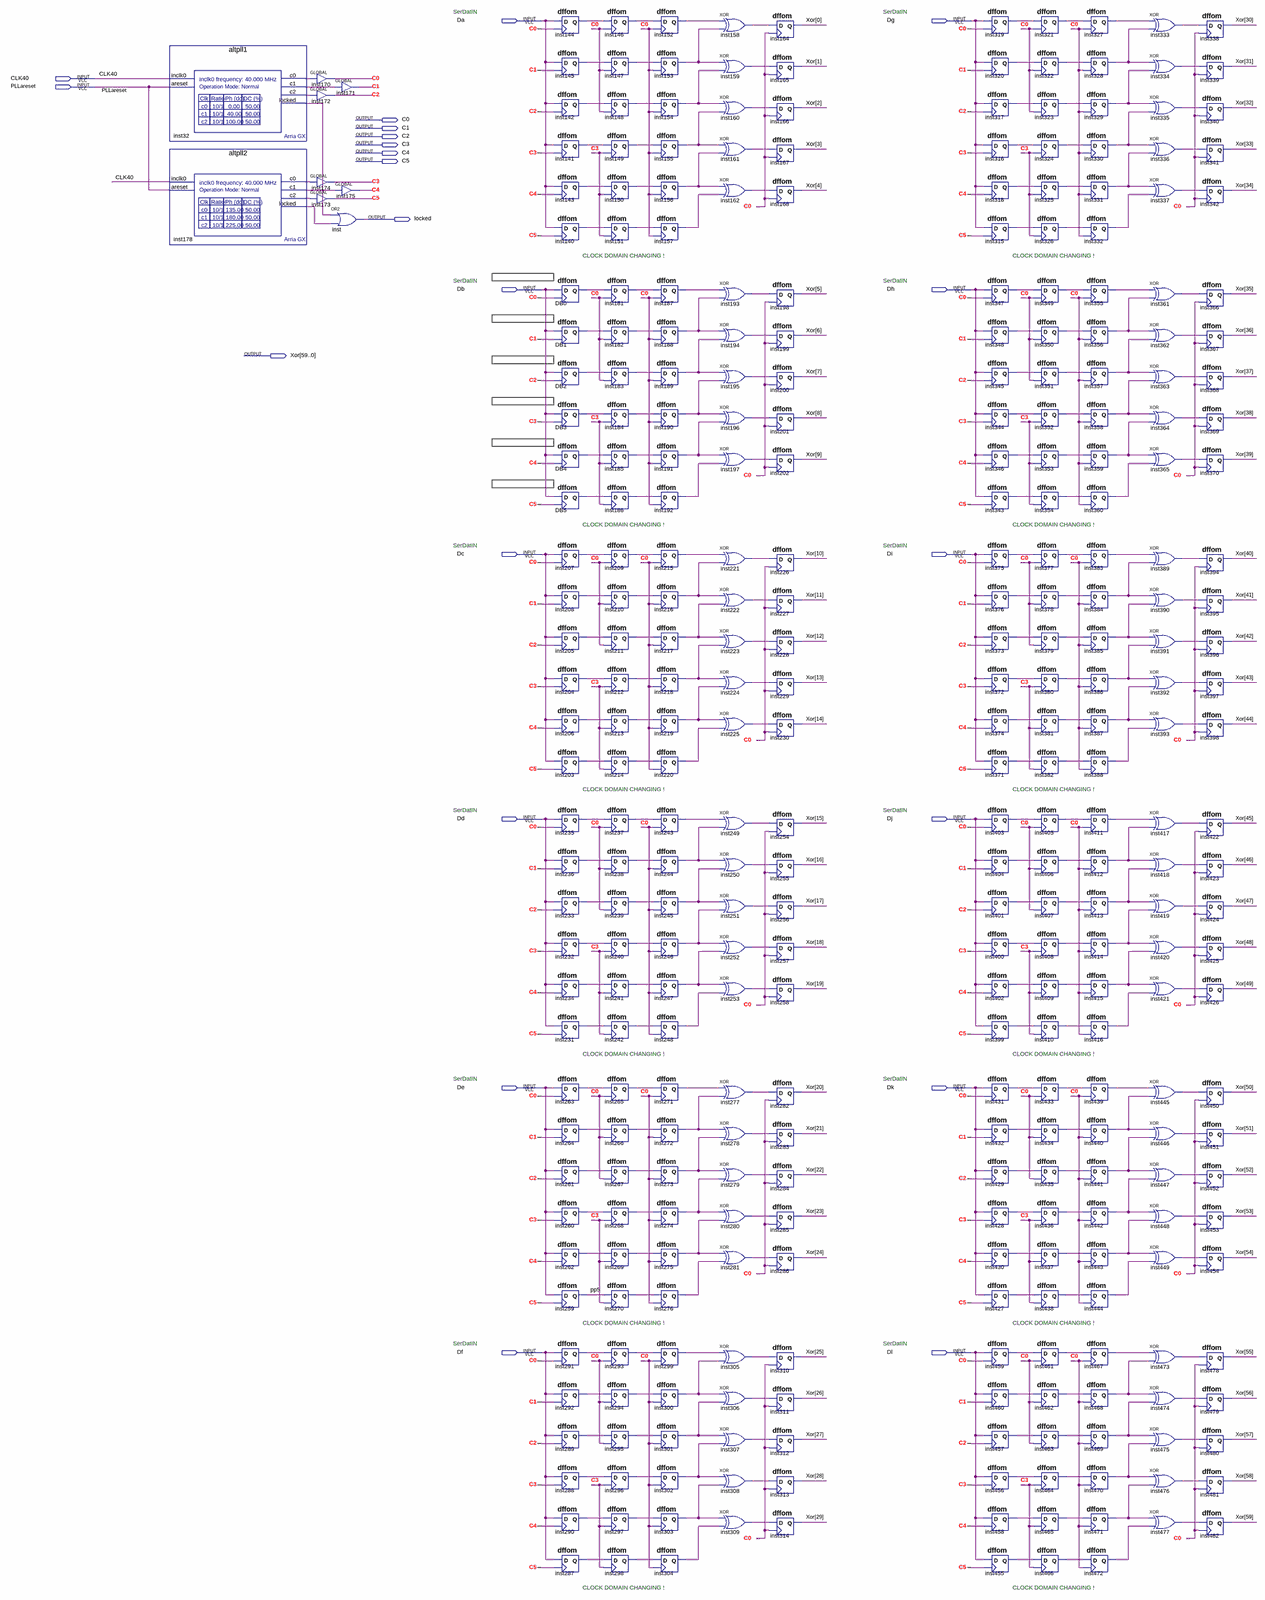
[diagram p0: schematic sheet, whole]
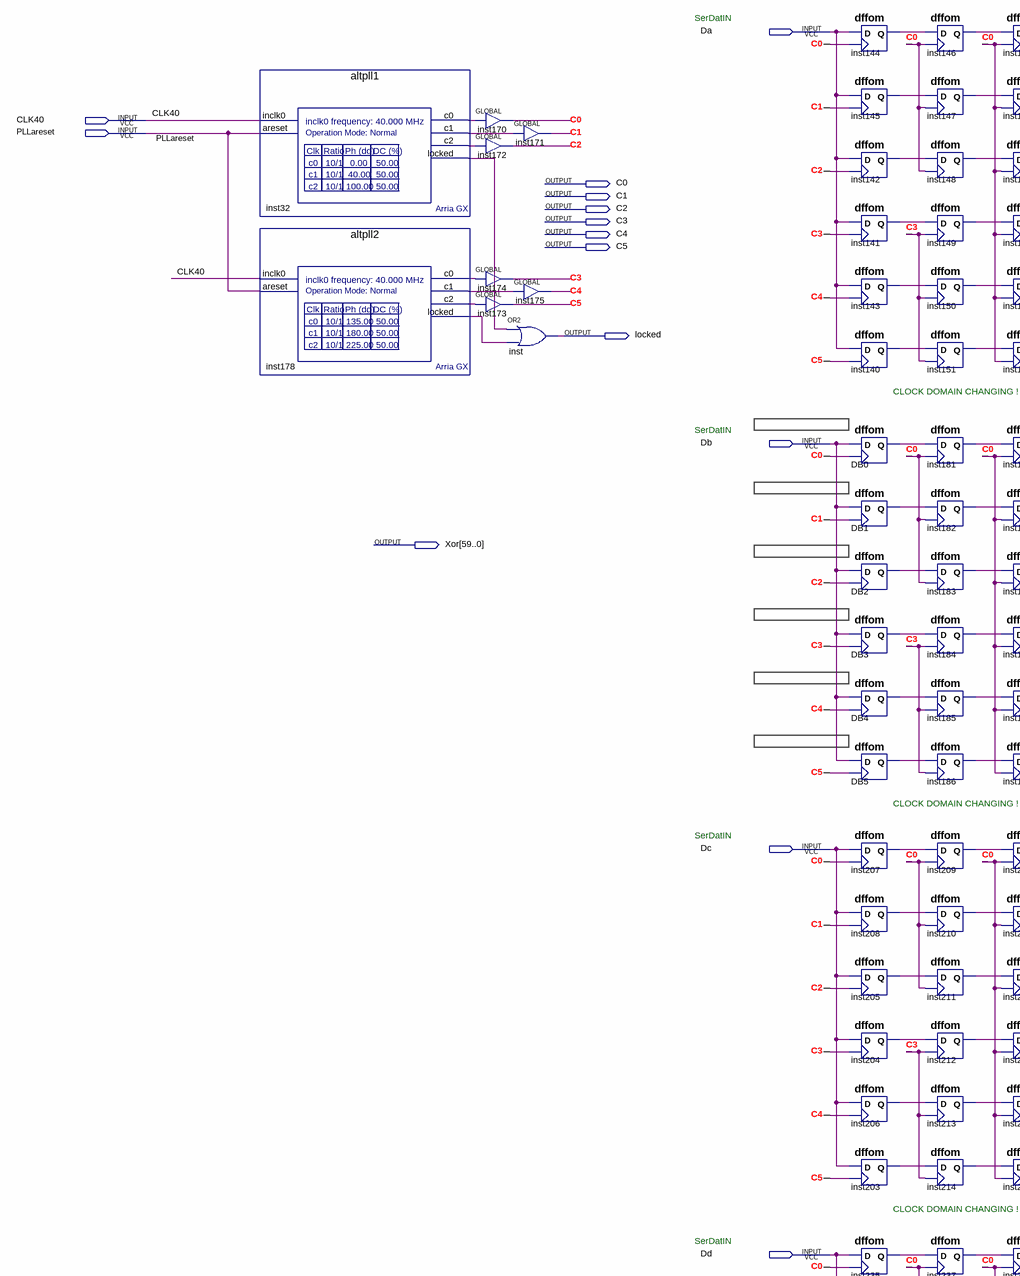
[diagram p1: schematic sheet, upper left part]
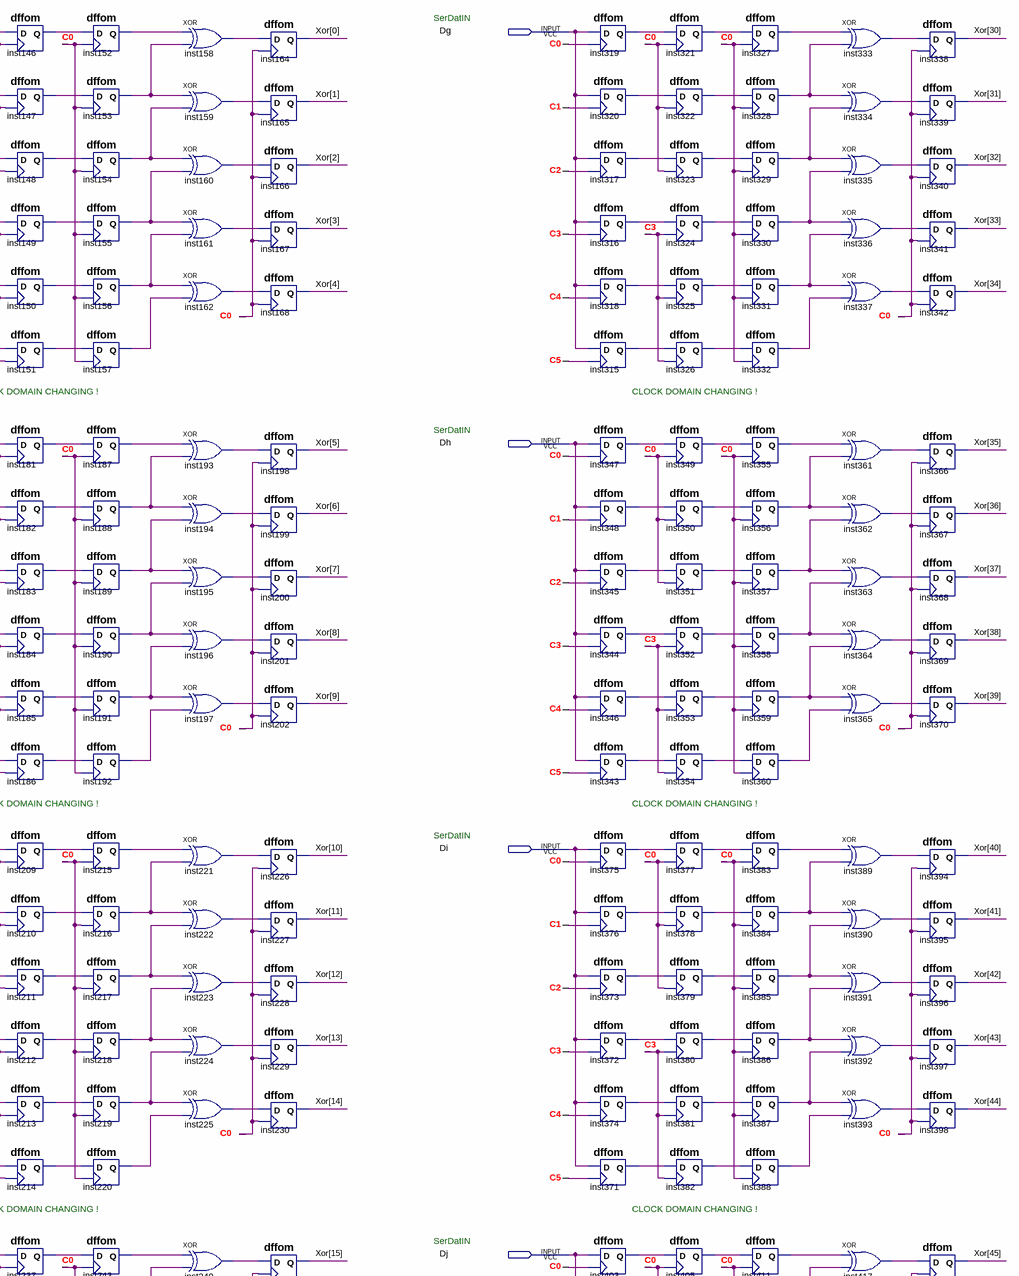
[diagram p2: schematic sheet, upper right part]
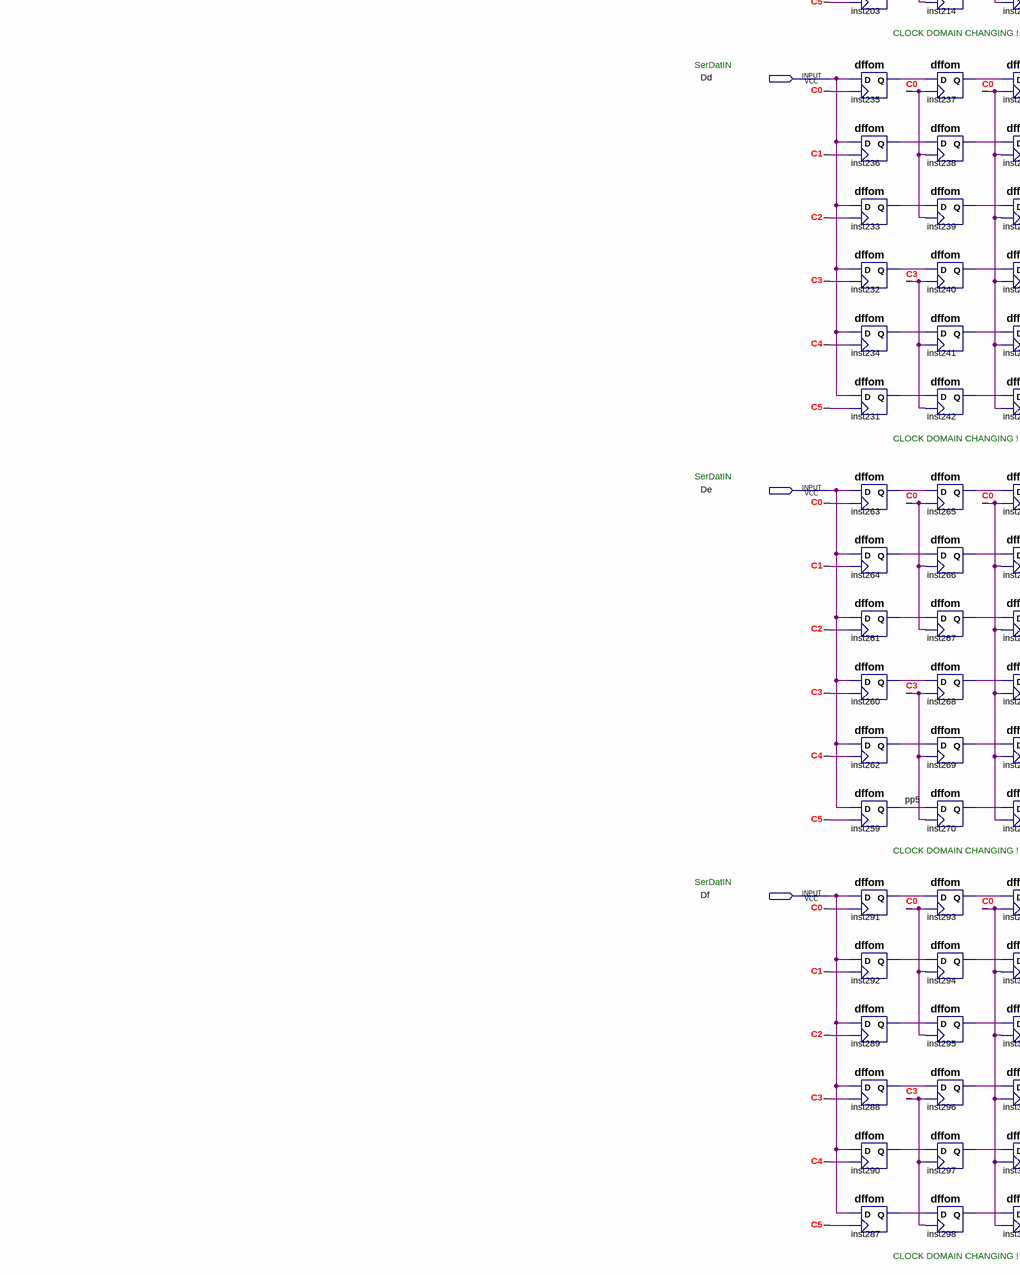
[diagram p3: schematic sheet, lower left part]
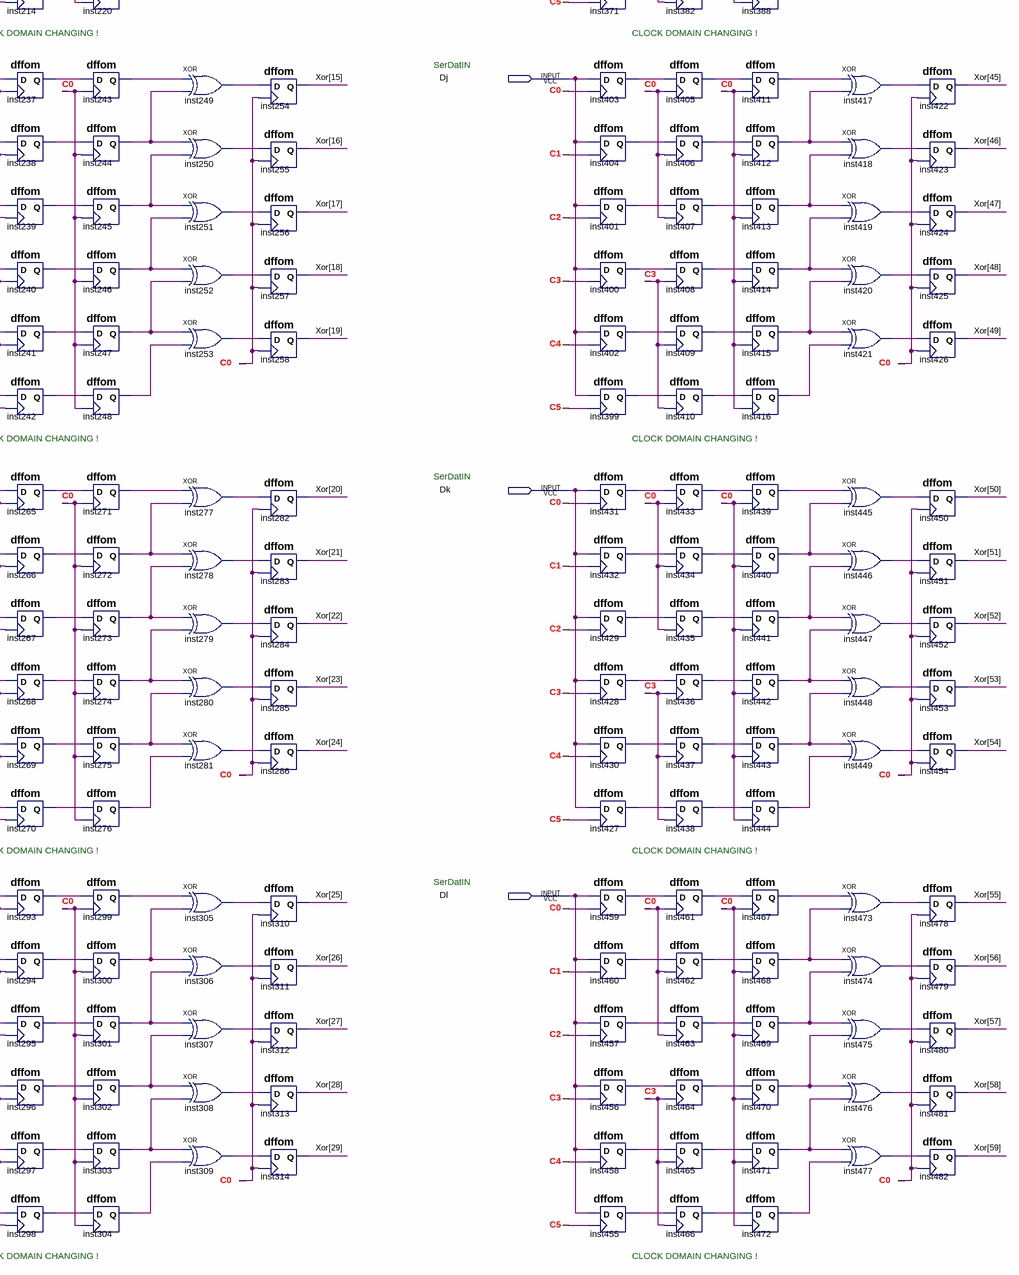
[diagram p4: schematic sheet, lower right part]
// Quartus schematic GXphase_finding.bdf as structural Verilog: 345 symbols, 22 pins
module GXphase_finding (
  input  Da,
  input  Dg,
  input  CLK40,
  input  PLLareset,
  input  Db,
  input  Dh,
  input  Dc,
  input  Di,
  input  Dd,
  input  Dj,
  input  De,
  input  Dk,
  input  Df,
  input  Dl,
  output C0,
  output C1,
  output C2,
  output C3,
  output C4,
  output C5,
  output locked,
  output [59:0] Xor
);

  wire DB0_q, DB1_q, DB2_q, DB3_q, DB4_q, DB5_q, inst32_c0, inst32_c1, inst32_c2, inst32_locked, inst140_q,
       inst141_q, inst142_q, inst143_q, inst144_q, inst145_q, inst146_q, inst147_q, inst148_q, inst149_q,
       inst150_q, inst151_q, inst152_q, inst153_q, inst154_q, inst155_q, inst156_q, inst157_q, inst158_out,
       inst159_out, inst160_out, inst161_out, inst162_out, inst178_c0, inst178_c1, inst178_c2,
       inst178_locked, inst181_q, inst182_q, inst183_q, inst184_q, inst185_q, inst186_q, inst187_q,
       inst188_q, inst189_q, inst190_q, inst191_q, inst192_q, inst193_out, inst194_out, inst195_out,
       inst196_out, inst197_out, inst203_q, inst204_q, inst205_q, inst206_q, inst207_q, inst208_q, inst209_q,
       inst210_q, inst211_q, inst212_q, inst213_q, inst214_q, inst215_q, inst216_q, inst217_q, inst218_q,
       inst219_q, inst220_q, inst221_out, inst222_out, inst223_out, inst224_out, inst225_out, inst231_q,
       inst232_q, inst233_q, inst234_q, inst235_q, inst236_q, inst237_q, inst238_q, inst239_q, inst240_q,
       inst241_q, inst242_q, inst243_q, inst244_q, inst245_q, inst246_q, inst247_q, inst248_q, inst249_out,
       inst250_out, inst251_out, inst252_out, inst253_out, inst260_q, inst261_q, inst262_q, inst263_q,
       inst264_q, inst265_q, inst266_q, inst267_q, inst268_q, inst269_q, inst270_q, inst271_q, inst272_q,
       inst273_q, inst274_q, inst275_q, inst276_q, inst277_out, inst278_out, inst279_out, inst280_out,
       inst281_out, inst287_q, inst288_q, inst289_q, inst290_q, inst291_q, inst292_q, inst293_q, inst294_q,
       inst295_q, inst296_q, inst297_q, inst298_q, inst299_q, inst300_q, inst301_q, inst302_q, inst303_q,
       inst304_q, inst305_out, inst306_out, inst307_out, inst308_out, inst309_out, inst315_q, inst316_q,
       inst317_q, inst318_q, inst319_q, inst320_q, inst321_q, inst322_q, inst323_q, inst324_q, inst325_q,
       inst326_q, inst327_q, inst328_q, inst329_q, inst330_q, inst331_q, inst332_q, inst333_out, inst334_out,
       inst335_out, inst336_out, inst337_out, inst343_q, inst344_q, inst345_q, inst346_q, inst347_q,
       inst348_q, inst349_q, inst350_q, inst351_q, inst352_q, inst353_q, inst354_q, inst355_q, inst356_q,
       inst357_q, inst358_q, inst359_q, inst360_q, inst361_out, inst362_out, inst363_out, inst364_out,
       inst365_out, inst371_q, inst372_q, inst373_q, inst374_q, inst375_q, inst376_q, inst377_q, inst378_q,
       inst379_q, inst380_q, inst381_q, inst382_q, inst383_q, inst384_q, inst385_q, inst386_q, inst387_q,
       inst388_q, inst389_out, inst390_out, inst391_out, inst392_out, inst393_out, inst399_q, inst400_q,
       inst401_q, inst402_q, inst403_q, inst404_q, inst405_q, inst406_q, inst407_q, inst408_q, inst409_q,
       inst410_q, inst411_q, inst412_q, inst413_q, inst414_q, inst415_q, inst416_q, inst417_out, inst418_out,
       inst419_out, inst420_out, inst421_out, inst427_q, inst428_q, inst429_q, inst430_q, inst431_q,
       inst432_q, inst433_q, inst434_q, inst435_q, inst436_q, inst437_q, inst438_q, inst439_q, inst440_q,
       inst441_q, inst442_q, inst443_q, inst444_q, inst445_out, inst446_out, inst447_out, inst448_out,
       inst449_out, inst455_q, inst456_q, inst457_q, inst458_q, inst459_q, inst460_q, inst461_q, inst462_q,
       inst463_q, inst464_q, inst465_q, inst466_q, inst467_q, inst468_q, inst469_q, inst470_q, inst471_q,
       inst472_q, inst473_out, inst474_out, inst475_out, inst476_out, inst477_out, pp5;

  altpll1 inst32 (
    .inclk0(CLK40), .areset(PLLareset), .c0(inst32_c0), .c1(inst32_c1), .c2(inst32_c2), .locked(inst32_locked));
  altpll2 inst178 (
    .inclk0(CLK40), .areset(PLLareset), .c0(inst178_c0), .c1(inst178_c1), .c2(inst178_c2),
    .locked(inst178_locked));
  GLOBAL inst170 (.IN(inst32_c0), .OUT(C0));
  GLOBAL inst172 (.IN(inst32_c2), .OUT(C2));
  GLOBAL inst174 (.IN(inst178_c0), .OUT(C3));
  GLOBAL inst173 (.IN(inst178_c2), .OUT(C5));
  GLOBAL inst171 (.IN(inst32_c1), .OUT(C1));
  GLOBAL inst175 (.IN(inst178_c1), .OUT(C4));
  or inst (locked, inst32_locked, inst178_locked);
  dffom inst144 (.D(Da), .CK(C0), .Q(inst144_q));
  dffom inst145 (.D(Da), .CK(C1), .Q(inst145_q));
  dffom inst142 (.D(Da), .CK(C2), .Q(inst142_q));
  dffom inst141 (.D(Da), .CK(C3), .Q(inst141_q));
  dffom inst143 (.D(Da), .CK(C4), .Q(inst143_q));
  dffom inst140 (.D(Da), .CK(C5), .Q(inst140_q));
  dffom DB0 (.D(Db), .CK(C0), .Q(DB0_q));
  dffom DB1 (.D(Db), .CK(C1), .Q(DB1_q));
  dffom DB2 (.D(Db), .CK(C2), .Q(DB2_q));
  dffom DB3 (.D(Db), .CK(C3), .Q(DB3_q));
  dffom DB4 (.D(Db), .CK(C4), .Q(DB4_q));
  dffom DB5 (.D(Db), .CK(C5), .Q(DB5_q));
  dffom inst207 (.D(Dc), .CK(C0), .Q(inst207_q));
  dffom inst208 (.D(Dc), .CK(C1), .Q(inst208_q));
  dffom inst205 (.D(Dc), .CK(C2), .Q(inst205_q));
  dffom inst204 (.D(Dc), .CK(C3), .Q(inst204_q));
  dffom inst206 (.D(Dc), .CK(C4), .Q(inst206_q));
  dffom inst203 (.D(Dc), .CK(C5), .Q(inst203_q));
  dffom inst235 (.D(Dd), .CK(C0), .Q(inst235_q));
  dffom inst236 (.D(Dd), .CK(C1), .Q(inst236_q));
  dffom inst233 (.D(Dd), .CK(C2), .Q(inst233_q));
  dffom inst232 (.D(Dd), .CK(C3), .Q(inst232_q));
  dffom inst234 (.D(Dd), .CK(C4), .Q(inst234_q));
  dffom inst231 (.D(Dd), .CK(C5), .Q(inst231_q));
  dffom inst263 (.D(De), .CK(C0), .Q(inst263_q));
  dffom inst264 (.D(De), .CK(C1), .Q(inst264_q));
  dffom inst261 (.D(De), .CK(C2), .Q(inst261_q));
  dffom inst260 (.D(De), .CK(C3), .Q(inst260_q));
  dffom inst262 (.D(De), .CK(C4), .Q(inst262_q));
  dffom inst259 (.D(De), .CK(C5), .Q(pp5));
  dffom inst291 (.D(Df), .CK(C0), .Q(inst291_q));
  dffom inst292 (.D(Df), .CK(C1), .Q(inst292_q));
  dffom inst289 (.D(Df), .CK(C2), .Q(inst289_q));
  dffom inst288 (.D(Df), .CK(C3), .Q(inst288_q));
  dffom inst290 (.D(Df), .CK(C4), .Q(inst290_q));
  dffom inst287 (.D(Df), .CK(C5), .Q(inst287_q));
  dffom inst146 (.D(inst144_q), .CK(C0), .Q(inst146_q));
  dffom inst147 (.D(inst145_q), .CK(C0), .Q(inst147_q));
  dffom inst148 (.D(inst142_q), .CK(C0), .Q(inst148_q));
  dffom inst149 (.D(inst141_q), .CK(C3), .Q(inst149_q));
  dffom inst150 (.D(inst143_q), .CK(C3), .Q(inst150_q));
  dffom inst151 (.D(inst140_q), .CK(C3), .Q(inst151_q));
  dffom inst181 (.D(DB0_q), .CK(C0), .Q(inst181_q));
  dffom inst182 (.D(DB1_q), .CK(C0), .Q(inst182_q));
  dffom inst183 (.D(DB2_q), .CK(C0), .Q(inst183_q));
  dffom inst184 (.D(DB3_q), .CK(C3), .Q(inst184_q));
  dffom inst185 (.D(DB4_q), .CK(C3), .Q(inst185_q));
  dffom inst186 (.D(DB5_q), .CK(C3), .Q(inst186_q));
  dffom inst209 (.D(inst207_q), .CK(C0), .Q(inst209_q));
  dffom inst210 (.D(inst208_q), .CK(C0), .Q(inst210_q));
  dffom inst211 (.D(inst205_q), .CK(C0), .Q(inst211_q));
  dffom inst212 (.D(inst204_q), .CK(C3), .Q(inst212_q));
  dffom inst213 (.D(inst206_q), .CK(C3), .Q(inst213_q));
  dffom inst214 (.D(inst203_q), .CK(C3), .Q(inst214_q));
  dffom inst237 (.D(inst235_q), .CK(C0), .Q(inst237_q));
  dffom inst238 (.D(inst236_q), .CK(C0), .Q(inst238_q));
  dffom inst239 (.D(inst233_q), .CK(C0), .Q(inst239_q));
  dffom inst240 (.D(inst232_q), .CK(C3), .Q(inst240_q));
  dffom inst241 (.D(inst234_q), .CK(C3), .Q(inst241_q));
  dffom inst242 (.D(inst231_q), .CK(C3), .Q(inst242_q));
  dffom inst265 (.D(inst263_q), .CK(C0), .Q(inst265_q));
  dffom inst266 (.D(inst264_q), .CK(C0), .Q(inst266_q));
  dffom inst267 (.D(inst261_q), .CK(C0), .Q(inst267_q));
  dffom inst268 (.D(inst260_q), .CK(C3), .Q(inst268_q));
  dffom inst269 (.D(inst262_q), .CK(C3), .Q(inst269_q));
  dffom inst270 (.D(pp5), .CK(C3), .Q(inst270_q));
  dffom inst293 (.D(inst291_q), .CK(C0), .Q(inst293_q));
  dffom inst294 (.D(inst292_q), .CK(C0), .Q(inst294_q));
  dffom inst295 (.D(inst289_q), .CK(C0), .Q(inst295_q));
  dffom inst296 (.D(inst288_q), .CK(C3), .Q(inst296_q));
  dffom inst297 (.D(inst290_q), .CK(C3), .Q(inst297_q));
  dffom inst298 (.D(inst287_q), .CK(C3), .Q(inst298_q));
  dffom inst152 (.D(inst146_q), .CK(C0), .Q(inst152_q));
  dffom inst153 (.D(inst147_q), .CK(C0), .Q(inst153_q));
  dffom inst154 (.D(inst148_q), .CK(C0), .Q(inst154_q));
  dffom inst155 (.D(inst149_q), .CK(C0), .Q(inst155_q));
  dffom inst156 (.D(inst150_q), .CK(C0), .Q(inst156_q));
  dffom inst157 (.D(inst151_q), .CK(C0), .Q(inst157_q));
  dffom inst187 (.D(inst181_q), .CK(C0), .Q(inst187_q));
  dffom inst188 (.D(inst182_q), .CK(C0), .Q(inst188_q));
  dffom inst189 (.D(inst183_q), .CK(C0), .Q(inst189_q));
  dffom inst190 (.D(inst184_q), .CK(C0), .Q(inst190_q));
  dffom inst191 (.D(inst185_q), .CK(C0), .Q(inst191_q));
  dffom inst192 (.D(inst186_q), .CK(C0), .Q(inst192_q));
  dffom inst215 (.D(inst209_q), .CK(C0), .Q(inst215_q));
  dffom inst216 (.D(inst210_q), .CK(C0), .Q(inst216_q));
  dffom inst217 (.D(inst211_q), .CK(C0), .Q(inst217_q));
  dffom inst218 (.D(inst212_q), .CK(C0), .Q(inst218_q));
  dffom inst219 (.D(inst213_q), .CK(C0), .Q(inst219_q));
  dffom inst220 (.D(inst214_q), .CK(C0), .Q(inst220_q));
  dffom inst243 (.D(inst237_q), .CK(C0), .Q(inst243_q));
  dffom inst244 (.D(inst238_q), .CK(C0), .Q(inst244_q));
  dffom inst245 (.D(inst239_q), .CK(C0), .Q(inst245_q));
  dffom inst246 (.D(inst240_q), .CK(C0), .Q(inst246_q));
  dffom inst247 (.D(inst241_q), .CK(C0), .Q(inst247_q));
  dffom inst248 (.D(inst242_q), .CK(C0), .Q(inst248_q));
  dffom inst271 (.D(inst265_q), .CK(C0), .Q(inst271_q));
  dffom inst272 (.D(inst266_q), .CK(C0), .Q(inst272_q));
  dffom inst273 (.D(inst267_q), .CK(C0), .Q(inst273_q));
  dffom inst274 (.D(inst268_q), .CK(C0), .Q(inst274_q));
  dffom inst275 (.D(inst269_q), .CK(C0), .Q(inst275_q));
  dffom inst276 (.D(inst270_q), .CK(C0), .Q(inst276_q));
  dffom inst299 (.D(inst293_q), .CK(C0), .Q(inst299_q));
  dffom inst300 (.D(inst294_q), .CK(C0), .Q(inst300_q));
  dffom inst301 (.D(inst295_q), .CK(C0), .Q(inst301_q));
  dffom inst302 (.D(inst296_q), .CK(C0), .Q(inst302_q));
  dffom inst303 (.D(inst297_q), .CK(C0), .Q(inst303_q));
  dffom inst304 (.D(inst298_q), .CK(C0), .Q(inst304_q));
  xor inst158 (inst158_out, inst152_q, inst153_q);
  xor inst159 (inst159_out, inst153_q, inst154_q);
  xor inst160 (inst160_out, inst154_q, inst155_q);
  xor inst161 (inst161_out, inst155_q, inst156_q);
  xor inst162 (inst162_out, inst156_q, inst157_q);
  xor inst193 (inst193_out, inst187_q, inst188_q);
  xor inst194 (inst194_out, inst188_q, inst189_q);
  xor inst195 (inst195_out, inst189_q, inst190_q);
  xor inst196 (inst196_out, inst190_q, inst191_q);
  xor inst197 (inst197_out, inst191_q, inst192_q);
  xor inst221 (inst221_out, inst215_q, inst216_q);
  xor inst222 (inst222_out, inst216_q, inst217_q);
  xor inst223 (inst223_out, inst217_q, inst218_q);
  xor inst224 (inst224_out, inst218_q, inst219_q);
  xor inst225 (inst225_out, inst219_q, inst220_q);
  xor inst249 (inst249_out, inst243_q, inst244_q);
  xor inst250 (inst250_out, inst244_q, inst245_q);
  xor inst251 (inst251_out, inst245_q, inst246_q);
  xor inst252 (inst252_out, inst246_q, inst247_q);
  xor inst253 (inst253_out, inst247_q, inst248_q);
  xor inst277 (inst277_out, inst271_q, inst272_q);
  xor inst278 (inst278_out, inst272_q, inst273_q);
  xor inst279 (inst279_out, inst273_q, inst274_q);
  xor inst280 (inst280_out, inst274_q, inst275_q);
  xor inst281 (inst281_out, inst275_q, inst276_q);
  xor inst305 (inst305_out, inst299_q, inst300_q);
  xor inst306 (inst306_out, inst300_q, inst301_q);
  xor inst307 (inst307_out, inst301_q, inst302_q);
  xor inst308 (inst308_out, inst302_q, inst303_q);
  xor inst309 (inst309_out, inst303_q, inst304_q);
  dffom inst164 (.D(inst158_out), .CK(C0), .Q(Xor[0]));
  dffom inst165 (.D(inst159_out), .CK(C0), .Q(Xor[1]));
  dffom inst166 (.D(inst160_out), .CK(C0), .Q(Xor[2]));
  dffom inst167 (.D(inst161_out), .CK(C0), .Q(Xor[3]));
  dffom inst168 (.D(inst162_out), .CK(C0), .Q(Xor[4]));
  dffom inst198 (.D(inst193_out), .CK(C0), .Q(Xor[5]));
  dffom inst199 (.D(inst194_out), .CK(C0), .Q(Xor[6]));
  dffom inst200 (.D(inst195_out), .CK(C0), .Q(Xor[7]));
  dffom inst201 (.D(inst196_out), .CK(C0), .Q(Xor[8]));
  dffom inst202 (.D(inst197_out), .CK(C0), .Q(Xor[9]));
  dffom inst226 (.D(inst221_out), .CK(C0), .Q(Xor[10]));
  dffom inst227 (.D(inst222_out), .CK(C0), .Q(Xor[11]));
  dffom inst228 (.D(inst223_out), .CK(C0), .Q(Xor[12]));
  dffom inst229 (.D(inst224_out), .CK(C0), .Q(Xor[13]));
  dffom inst230 (.D(inst225_out), .CK(C0), .Q(Xor[14]));
  dffom inst254 (.D(inst249_out), .CK(C0), .Q(Xor[15]));
  dffom inst255 (.D(inst250_out), .CK(C0), .Q(Xor[16]));
  dffom inst256 (.D(inst251_out), .CK(C0), .Q(Xor[17]));
  dffom inst257 (.D(inst252_out), .CK(C0), .Q(Xor[18]));
  dffom inst258 (.D(inst253_out), .CK(C0), .Q(Xor[19]));
  dffom inst282 (.D(inst277_out), .CK(C0), .Q(Xor[20]));
  dffom inst283 (.D(inst278_out), .CK(C0), .Q(Xor[21]));
  dffom inst284 (.D(inst279_out), .CK(C0), .Q(Xor[22]));
  dffom inst285 (.D(inst280_out), .CK(C0), .Q(Xor[23]));
  dffom inst286 (.D(inst281_out), .CK(C0), .Q(Xor[24]));
  dffom inst310 (.D(inst305_out), .CK(C0), .Q(Xor[25]));
  dffom inst311 (.D(inst306_out), .CK(C0), .Q(Xor[26]));
  dffom inst312 (.D(inst307_out), .CK(C0), .Q(Xor[27]));
  dffom inst313 (.D(inst308_out), .CK(C0), .Q(Xor[28]));
  dffom inst314 (.D(inst309_out), .CK(C0), .Q(Xor[29]));
  dffom inst319 (.D(Dg), .CK(C0), .Q(inst319_q));
  dffom inst320 (.D(Dg), .CK(C1), .Q(inst320_q));
  dffom inst317 (.D(Dg), .CK(C2), .Q(inst317_q));
  dffom inst316 (.D(Dg), .CK(C3), .Q(inst316_q));
  dffom inst318 (.D(Dg), .CK(C4), .Q(inst318_q));
  dffom inst315 (.D(Dg), .CK(C5), .Q(inst315_q));
  dffom inst347 (.D(Dh), .CK(C0), .Q(inst347_q));
  dffom inst348 (.D(Dh), .CK(C1), .Q(inst348_q));
  dffom inst345 (.D(Dh), .CK(C2), .Q(inst345_q));
  dffom inst344 (.D(Dh), .CK(C3), .Q(inst344_q));
  dffom inst346 (.D(Dh), .CK(C4), .Q(inst346_q));
  dffom inst343 (.D(Dh), .CK(C5), .Q(inst343_q));
  dffom inst375 (.D(Di), .CK(C0), .Q(inst375_q));
  dffom inst376 (.D(Di), .CK(C1), .Q(inst376_q));
  dffom inst373 (.D(Di), .CK(C2), .Q(inst373_q));
  dffom inst372 (.D(Di), .CK(C3), .Q(inst372_q));
  dffom inst374 (.D(Di), .CK(C4), .Q(inst374_q));
  dffom inst371 (.D(Di), .CK(C5), .Q(inst371_q));
  dffom inst403 (.D(Dj), .CK(C0), .Q(inst403_q));
  dffom inst404 (.D(Dj), .CK(C1), .Q(inst404_q));
  dffom inst401 (.D(Dj), .CK(C2), .Q(inst401_q));
  dffom inst400 (.D(Dj), .CK(C3), .Q(inst400_q));
  dffom inst402 (.D(Dj), .CK(C4), .Q(inst402_q));
  dffom inst399 (.D(Dj), .CK(C5), .Q(inst399_q));
  dffom inst431 (.D(Dk), .CK(C0), .Q(inst431_q));
  dffom inst432 (.D(Dk), .CK(C1), .Q(inst432_q));
  dffom inst429 (.D(Dk), .CK(C2), .Q(inst429_q));
  dffom inst428 (.D(Dk), .CK(C3), .Q(inst428_q));
  dffom inst430 (.D(Dk), .CK(C4), .Q(inst430_q));
  dffom inst427 (.D(Dk), .CK(C5), .Q(inst427_q));
  dffom inst459 (.D(Dl), .CK(C0), .Q(inst459_q));
  dffom inst460 (.D(Dl), .CK(C1), .Q(inst460_q));
  dffom inst457 (.D(Dl), .CK(C2), .Q(inst457_q));
  dffom inst456 (.D(Dl), .CK(C3), .Q(inst456_q));
  dffom inst458 (.D(Dl), .CK(C4), .Q(inst458_q));
  dffom inst455 (.D(Dl), .CK(C5), .Q(inst455_q));
  dffom inst321 (.D(inst319_q), .CK(C0), .Q(inst321_q));
  dffom inst322 (.D(inst320_q), .CK(C0), .Q(inst322_q));
  dffom inst323 (.D(inst317_q), .CK(C0), .Q(inst323_q));
  dffom inst324 (.D(inst316_q), .CK(C3), .Q(inst324_q));
  dffom inst325 (.D(inst318_q), .CK(C3), .Q(inst325_q));
  dffom inst326 (.D(inst315_q), .CK(C3), .Q(inst326_q));
  dffom inst349 (.D(inst347_q), .CK(C0), .Q(inst349_q));
  dffom inst350 (.D(inst348_q), .CK(C0), .Q(inst350_q));
  dffom inst351 (.D(inst345_q), .CK(C0), .Q(inst351_q));
  dffom inst352 (.D(inst344_q), .CK(C3), .Q(inst352_q));
  dffom inst353 (.D(inst346_q), .CK(C3), .Q(inst353_q));
  dffom inst354 (.D(inst343_q), .CK(C3), .Q(inst354_q));
  dffom inst377 (.D(inst375_q), .CK(C0), .Q(inst377_q));
  dffom inst378 (.D(inst376_q), .CK(C0), .Q(inst378_q));
  dffom inst379 (.D(inst373_q), .CK(C0), .Q(inst379_q));
  dffom inst380 (.D(inst372_q), .CK(C3), .Q(inst380_q));
  dffom inst381 (.D(inst374_q), .CK(C3), .Q(inst381_q));
  dffom inst382 (.D(inst371_q), .CK(C3), .Q(inst382_q));
  dffom inst405 (.D(inst403_q), .CK(C0), .Q(inst405_q));
  dffom inst406 (.D(inst404_q), .CK(C0), .Q(inst406_q));
  dffom inst407 (.D(inst401_q), .CK(C0), .Q(inst407_q));
  dffom inst408 (.D(inst400_q), .CK(C3), .Q(inst408_q));
  dffom inst409 (.D(inst402_q), .CK(C3), .Q(inst409_q));
  dffom inst410 (.D(inst399_q), .CK(C3), .Q(inst410_q));
  dffom inst433 (.D(inst431_q), .CK(C0), .Q(inst433_q));
  dffom inst434 (.D(inst432_q), .CK(C0), .Q(inst434_q));
  dffom inst435 (.D(inst429_q), .CK(C0), .Q(inst435_q));
  dffom inst436 (.D(inst428_q), .CK(C3), .Q(inst436_q));
  dffom inst437 (.D(inst430_q), .CK(C3), .Q(inst437_q));
  dffom inst438 (.D(inst427_q), .CK(C3), .Q(inst438_q));
  dffom inst461 (.D(inst459_q), .CK(C0), .Q(inst461_q));
  dffom inst462 (.D(inst460_q), .CK(C0), .Q(inst462_q));
  dffom inst463 (.D(inst457_q), .CK(C0), .Q(inst463_q));
  dffom inst464 (.D(inst456_q), .CK(C3), .Q(inst464_q));
  dffom inst465 (.D(inst458_q), .CK(C3), .Q(inst465_q));
  dffom inst466 (.D(inst455_q), .CK(C3), .Q(inst466_q));
  dffom inst327 (.D(inst321_q), .CK(C0), .Q(inst327_q));
  dffom inst328 (.D(inst322_q), .CK(C0), .Q(inst328_q));
  dffom inst329 (.D(inst323_q), .CK(C0), .Q(inst329_q));
  dffom inst330 (.D(inst324_q), .CK(C0), .Q(inst330_q));
  dffom inst331 (.D(inst325_q), .CK(C0), .Q(inst331_q));
  dffom inst332 (.D(inst326_q), .CK(C0), .Q(inst332_q));
  dffom inst355 (.D(inst349_q), .CK(C0), .Q(inst355_q));
  dffom inst356 (.D(inst350_q), .CK(C0), .Q(inst356_q));
  dffom inst357 (.D(inst351_q), .CK(C0), .Q(inst357_q));
  dffom inst358 (.D(inst352_q), .CK(C0), .Q(inst358_q));
  dffom inst359 (.D(inst353_q), .CK(C0), .Q(inst359_q));
  dffom inst360 (.D(inst354_q), .CK(C0), .Q(inst360_q));
  dffom inst383 (.D(inst377_q), .CK(C0), .Q(inst383_q));
  dffom inst384 (.D(inst378_q), .CK(C0), .Q(inst384_q));
  dffom inst385 (.D(inst379_q), .CK(C0), .Q(inst385_q));
  dffom inst386 (.D(inst380_q), .CK(C0), .Q(inst386_q));
  dffom inst387 (.D(inst381_q), .CK(C0), .Q(inst387_q));
  dffom inst388 (.D(inst382_q), .CK(C0), .Q(inst388_q));
  dffom inst411 (.D(inst405_q), .CK(C0), .Q(inst411_q));
  dffom inst412 (.D(inst406_q), .CK(C0), .Q(inst412_q));
  dffom inst413 (.D(inst407_q), .CK(C0), .Q(inst413_q));
  dffom inst414 (.D(inst408_q), .CK(C0), .Q(inst414_q));
  dffom inst415 (.D(inst409_q), .CK(C0), .Q(inst415_q));
  dffom inst416 (.D(inst410_q), .CK(C0), .Q(inst416_q));
  dffom inst439 (.D(inst433_q), .CK(C0), .Q(inst439_q));
  dffom inst440 (.D(inst434_q), .CK(C0), .Q(inst440_q));
  dffom inst441 (.D(inst435_q), .CK(C0), .Q(inst441_q));
  dffom inst442 (.D(inst436_q), .CK(C0), .Q(inst442_q));
  dffom inst443 (.D(inst437_q), .CK(C0), .Q(inst443_q));
  dffom inst444 (.D(inst438_q), .CK(C0), .Q(inst444_q));
  dffom inst467 (.D(inst461_q), .CK(C0), .Q(inst467_q));
  dffom inst468 (.D(inst462_q), .CK(C0), .Q(inst468_q));
  dffom inst469 (.D(inst463_q), .CK(C0), .Q(inst469_q));
  dffom inst470 (.D(inst464_q), .CK(C0), .Q(inst470_q));
  dffom inst471 (.D(inst465_q), .CK(C0), .Q(inst471_q));
  dffom inst472 (.D(inst466_q), .CK(C0), .Q(inst472_q));
  xor inst333 (inst333_out, inst327_q, inst328_q);
  xor inst334 (inst334_out, inst328_q, inst329_q);
  xor inst335 (inst335_out, inst329_q, inst330_q);
  xor inst336 (inst336_out, inst330_q, inst331_q);
  xor inst337 (inst337_out, inst331_q, inst332_q);
  xor inst361 (inst361_out, inst355_q, inst356_q);
  xor inst362 (inst362_out, inst356_q, inst357_q);
  xor inst363 (inst363_out, inst357_q, inst358_q);
  xor inst364 (inst364_out, inst358_q, inst359_q);
  xor inst365 (inst365_out, inst359_q, inst360_q);
  xor inst389 (inst389_out, inst383_q, inst384_q);
  xor inst390 (inst390_out, inst384_q, inst385_q);
  xor inst391 (inst391_out, inst385_q, inst386_q);
  xor inst392 (inst392_out, inst386_q, inst387_q);
  xor inst393 (inst393_out, inst387_q, inst388_q);
  xor inst417 (inst417_out, inst411_q, inst412_q);
  xor inst418 (inst418_out, inst412_q, inst413_q);
  xor inst419 (inst419_out, inst413_q, inst414_q);
  xor inst420 (inst420_out, inst414_q, inst415_q);
  xor inst421 (inst421_out, inst415_q, inst416_q);
  xor inst445 (inst445_out, inst439_q, inst440_q);
  xor inst446 (inst446_out, inst440_q, inst441_q);
  xor inst447 (inst447_out, inst441_q, inst442_q);
  xor inst448 (inst448_out, inst442_q, inst443_q);
  xor inst449 (inst449_out, inst443_q, inst444_q);
  xor inst473 (inst473_out, inst467_q, inst468_q);
  xor inst474 (inst474_out, inst468_q, inst469_q);
  xor inst475 (inst475_out, inst469_q, inst470_q);
  xor inst476 (inst476_out, inst470_q, inst471_q);
  xor inst477 (inst477_out, inst471_q, inst472_q);
  dffom inst338 (.D(inst333_out), .CK(C0), .Q(Xor[30]));
  dffom inst339 (.D(inst334_out), .CK(C0), .Q(Xor[31]));
  dffom inst340 (.D(inst335_out), .CK(C0), .Q(Xor[32]));
  dffom inst341 (.D(inst336_out), .CK(C0), .Q(Xor[33]));
  dffom inst342 (.D(inst337_out), .CK(C0), .Q(Xor[34]));
  dffom inst366 (.D(inst361_out), .CK(C0), .Q(Xor[35]));
  dffom inst367 (.D(inst362_out), .CK(C0), .Q(Xor[36]));
  dffom inst368 (.D(inst363_out), .CK(C0), .Q(Xor[37]));
  dffom inst369 (.D(inst364_out), .CK(C0), .Q(Xor[38]));
  dffom inst370 (.D(inst365_out), .CK(C0), .Q(Xor[39]));
  dffom inst394 (.D(inst389_out), .CK(C0), .Q(Xor[40]));
  dffom inst395 (.D(inst390_out), .CK(C0), .Q(Xor[41]));
  dffom inst396 (.D(inst391_out), .CK(C0), .Q(Xor[42]));
  dffom inst397 (.D(inst392_out), .CK(C0), .Q(Xor[43]));
  dffom inst398 (.D(inst393_out), .CK(C0), .Q(Xor[44]));
  dffom inst422 (.D(inst417_out), .CK(C0), .Q(Xor[45]));
  dffom inst423 (.D(inst418_out), .CK(C0), .Q(Xor[46]));
  dffom inst424 (.D(inst419_out), .CK(C0), .Q(Xor[47]));
  dffom inst425 (.D(inst420_out), .CK(C0), .Q(Xor[48]));
  dffom inst426 (.D(inst421_out), .CK(C0), .Q(Xor[49]));
  dffom inst450 (.D(inst445_out), .CK(C0), .Q(Xor[50]));
  dffom inst451 (.D(inst446_out), .CK(C0), .Q(Xor[51]));
  dffom inst452 (.D(inst447_out), .CK(C0), .Q(Xor[52]));
  dffom inst453 (.D(inst448_out), .CK(C0), .Q(Xor[53]));
  dffom inst454 (.D(inst449_out), .CK(C0), .Q(Xor[54]));
  dffom inst478 (.D(inst473_out), .CK(C0), .Q(Xor[55]));
  dffom inst479 (.D(inst474_out), .CK(C0), .Q(Xor[56]));
  dffom inst480 (.D(inst475_out), .CK(C0), .Q(Xor[57]));
  dffom inst481 (.D(inst476_out), .CK(C0), .Q(Xor[58]));
  dffom inst482 (.D(inst477_out), .CK(C0), .Q(Xor[59]));

  // Notes on the sheet:
  //   SerDatIN
  //   SerDatIN
  //   -
  //   -
  //   CLOCK DOMAIN CHANGING !
  //   CLOCK DOMAIN CHANGING !
  //   SerDatIN
  //   SerDatIN
  //   -
  //   -
  //   CLOCK DOMAIN CHANGING !
  //   CLOCK DOMAIN CHANGING !
  //   SerDatIN
  //   SerDatIN
  //   -
  //   -
  //   CLOCK DOMAIN CHANGING !
  //   CLOCK DOMAIN CHANGING !
  //   SerDatIN
  //   SerDatIN
  //   -
  //   -
  //   CLOCK DOMAIN CHANGING !
  //   CLOCK DOMAIN CHANGING !
  //   SerDatIN
  //   SerDatIN
  //   -
  //   -
  //   CLOCK DOMAIN CHANGING !
  //   CLOCK DOMAIN CHANGING !
  //   SerDatIN
  //   SerDatIN
  //   -
  //   -
  //   CLOCK DOMAIN CHANGING !
  //   CLOCK DOMAIN CHANGING !
endmodule
